# Altium schematic sheet Audio.SchDoc
size A; DrawnBy: Duc Huy Le; SheetNumber: 4; SheetTotal: 4
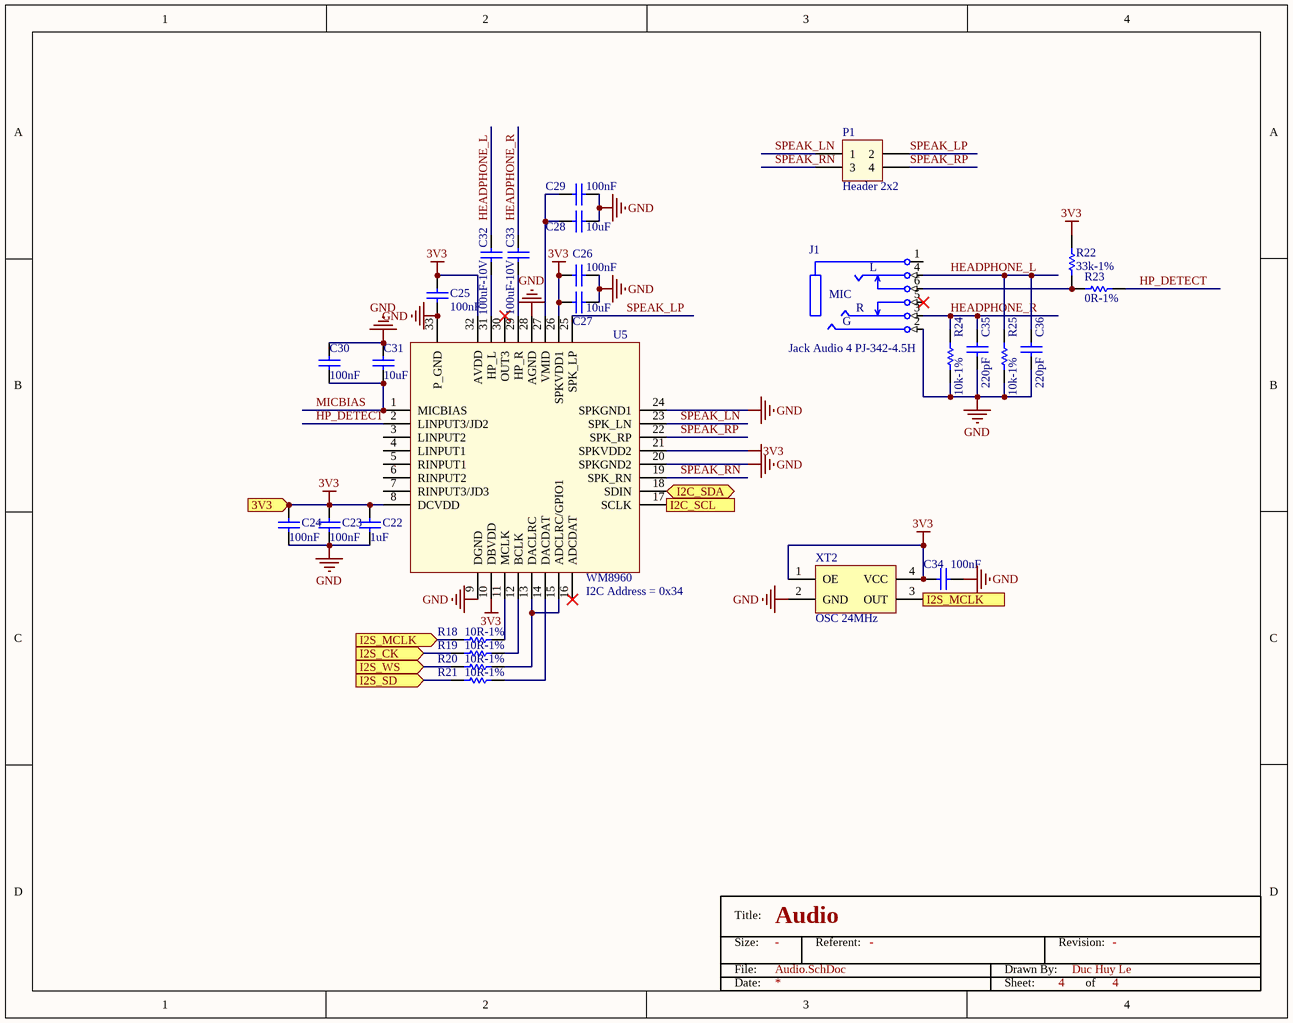
[diagram p0: Audio.SchDoc]

## Parts
C22  1uF  [Cap 0603]
C23  100nF  [Cap 0603]
C24  100nF  [Cap 0603]
C25  100nF  [Cap 0603]
C26  100nF  [Cap 0603]
C27  10uF  [Cap 0603]
C28  10uF  [Cap 0603]
C29  100nF  [Cap 0603]
C30  100nF  [Cap 0603]
C31  10uF  [Cap 0603]
C32  100uF-10V  [Cap 1210]
C33  100uF-10V  [Cap 1210]
C34  100nF  [Cap 0603]
C35  220pF  [Cap 0603]
C36  220pF  [Cap 0603]
J1  Jack Audio 4 PJ-342-4.5H  [PJ-342]
P1  Header 2x2  [Header 2mm 2x2]
R18  10R-1%  [Res 0603]
R19  10R-1%  [Res 0603]
R20  10R-1%  [Res 0603]
R21  10R-1%  [Res 0603]
R22  33k-1%  [Res 0603]
R23  0R-1%  [Res 0603]
R24  10k-1%  [Res 0603]
R25  10k-1%  [Res 0603]
TitleBlock4  Title: Audio  (hidden comment: Title Block)
U5  WM8960  [QFN-32 5X5]
XT2  OSC 24MHz  [Crystal 3225]

## Ports
3V3 (in), I2C_SCL (in), I2C_SDA (bidir), I2S_CK (in), I2S_MCLK (in), I2S_MCLK (out), I2S_SD (in), I2S_WS (in)

## Nets
3V3: C22.1 C23.1 C24.1 C25.1 C26.1 C27.1 C34.1 R22.2 U5.8(DCVDD) U5.10(DBVDD) U5.21(SPKVDD2) U5.26(SPKVDD1) U5.32(AVDD) XT2.1(OE) XT2.4(VCC) ; port 3V3
GND: C22.2 C23.2 C24.2 C25.2 C26.2 C27.2 C28.2 C29.2 C30.2 C31.2 C34.2 C35.1 C36.1 J1.2(R) R24.2 R25.2 U5.9(DGND) U5.20(SPKGND2) U5.24(SPKGND1) U5.28(AGND) U5.33(P_GND) XT2.2(GND)
HEADPHONE_L: C32.2 C36.2 J1.4(T) R25.1
HEADPHONE_R: C33.2 C35.2 J1.3(R) R24.1
HP_DETECT: R23.1 U5.2(LINPUT3/JD2)
I2C_SCL: U5.17(SCLK) ; port I2C_SCL
I2C_SDA: U5.18(SDIN) ; port I2C_SDA
I2S_CK: R19.1 ; port I2S_CK
I2S_MCLK: R18.1 XT2.3(OUT) ; port I2S_MCLK
I2S_SD: R21.1 ; port I2S_SD
I2S_WS: R20.1 ; port I2S_WS
MICBIAS: C30.1 C31.1 U5.1(MICBIAS)
SPEAK_LN: P1.1 U5.23(SPK_LN)
SPEAK_LP: P1.2 U5.25(SPK_LP)
SPEAK_RN: P1.3 U5.19(SPK_RN)
SPEAK_RP: P1.4 U5.22(SPK_RP)
NetC28_1: C28.1 C29.1 U5.27(VMID)
NetC32_1: C32.1 U5.31(HP_L)
NetC33_1: C33.1 U5.29(HP_R)
NetJ1_6: J1.6(T) R22.1 R23.2
NetR18_2: R18.2 U5.11(MCLK)
NetR19_2: R19.2 U5.12(BCLK)
NetR20_2: R20.2 U5.13(DACLRC) U5.15(ADCLRC/GPIO1)
NetR21_2: R21.2 U5.14(DACDAT)

Not connected (* = marked no-connect by the designer): J1 1(S) 5(T)*; U5 3(LINPUT2) 4(LINPUT1) 5(RINPUT1) 6(RINPUT2) 7(RINPUT3/JD3) 16(ADCDAT)* 30(OUT3)*

## Notes on the sheet
- (near U5) I2C Address = 0x34
- (in symbol Jack Audio 4 PJ-342-4.5H) L; MIC; G
- (in symbol Title Block) Title:; Size:; Referent:; Revision:; File:; Drawn By:; Date:; Sheet:; of

## Library data of the parts
C22-C36 = Cap: Cap SMD
J1 = Jack Audio 4 PJ-342-4.5H: Jack Audio 3.5 4 pole CTIA use for: Samsung, Apple, Sony
R18-R25 = Res: Res SMD
U5 = WM8960: Stereo CODEC with 1W Stereo Class D Speaker Drivers and Headphone Drivers for Portable Audio Applications
XT2 = XTAL- 4 Pins: Xtal - OSC
TitleBlock4 = Title Block: Revision: -; Referent: -; Size: -